# Altium project buffer_board.PrjPcb
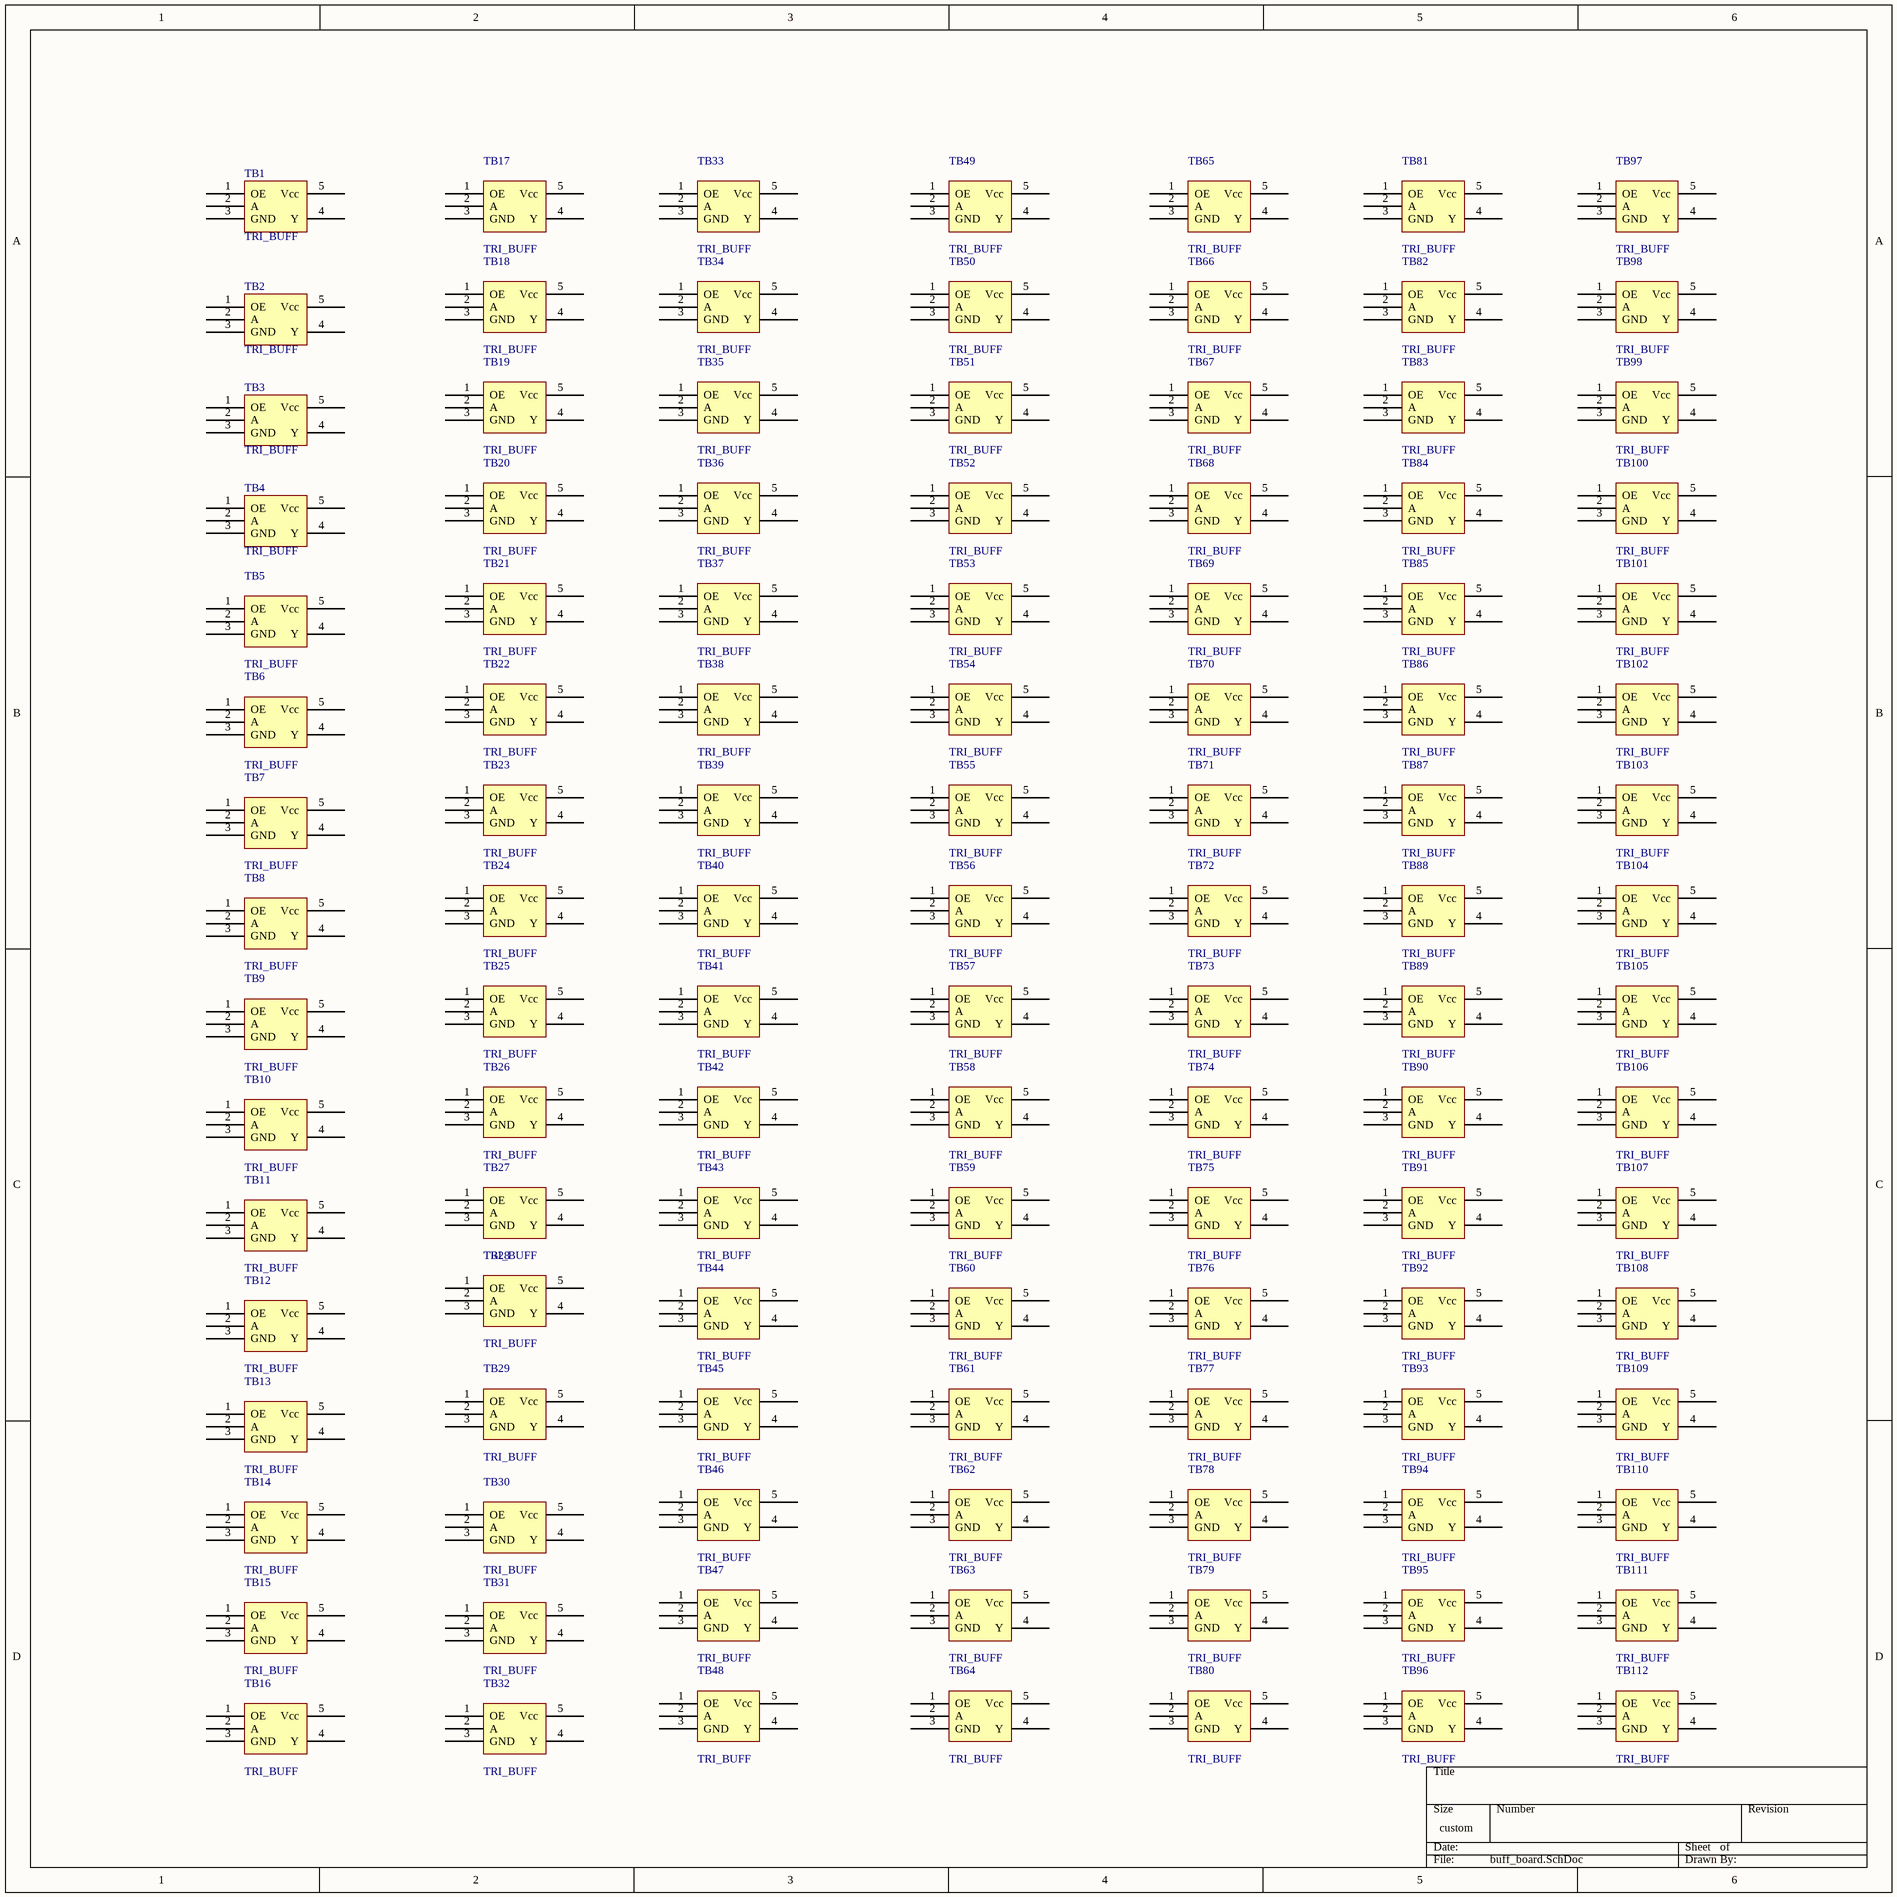
[diagram p0: buff_board.SchDoc]
1 sheet, 112 parts. Net scope: global (net labels, ports and power ports of the same name join across sheets).

## Sheet buff_board.SchDoc: =Buffer Board
size 381 x 381 mm; Author: Norman Gifford

### Parts
TB1  TRI_BUFF
TB2  TRI_BUFF
TB3  TRI_BUFF
TB4  TRI_BUFF
TB5  TRI_BUFF
TB6  TRI_BUFF
TB7  TRI_BUFF
TB8  TRI_BUFF
TB9  TRI_BUFF
TB10  TRI_BUFF
TB11  TRI_BUFF
TB12  TRI_BUFF
TB13  TRI_BUFF
TB14  TRI_BUFF
TB15  TRI_BUFF
TB16  TRI_BUFF
TB17  TRI_BUFF
TB18  TRI_BUFF
TB19  TRI_BUFF
TB20  TRI_BUFF
TB21  TRI_BUFF
TB22  TRI_BUFF
TB23  TRI_BUFF
TB24  TRI_BUFF
TB25  TRI_BUFF
TB26  TRI_BUFF
TB27  TRI_BUFF
TB28  TRI_BUFF
TB29  TRI_BUFF
TB30  TRI_BUFF
TB31  TRI_BUFF
TB32  TRI_BUFF
TB33  TRI_BUFF
TB34  TRI_BUFF
TB35  TRI_BUFF
TB36  TRI_BUFF
TB37  TRI_BUFF
TB38  TRI_BUFF
TB39  TRI_BUFF
TB40  TRI_BUFF
TB41  TRI_BUFF
TB42  TRI_BUFF
TB43  TRI_BUFF
TB44  TRI_BUFF
TB45  TRI_BUFF
TB46  TRI_BUFF
TB47  TRI_BUFF
TB48  TRI_BUFF
TB49  TRI_BUFF
TB50  TRI_BUFF
TB51  TRI_BUFF
TB52  TRI_BUFF
TB53  TRI_BUFF
TB54  TRI_BUFF
TB55  TRI_BUFF
TB56  TRI_BUFF
TB57  TRI_BUFF
TB58  TRI_BUFF
TB59  TRI_BUFF
TB60  TRI_BUFF
TB61  TRI_BUFF
TB62  TRI_BUFF
TB63  TRI_BUFF
TB64  TRI_BUFF
TB65  TRI_BUFF
TB66  TRI_BUFF
TB67  TRI_BUFF
TB68  TRI_BUFF
TB69  TRI_BUFF
TB70  TRI_BUFF
TB71  TRI_BUFF
TB72  TRI_BUFF
TB73  TRI_BUFF
TB74  TRI_BUFF
TB75  TRI_BUFF
TB76  TRI_BUFF
TB77  TRI_BUFF
TB78  TRI_BUFF
TB79  TRI_BUFF
TB80  TRI_BUFF
TB81  TRI_BUFF
TB82  TRI_BUFF
TB83  TRI_BUFF
TB84  TRI_BUFF
TB85  TRI_BUFF
TB86  TRI_BUFF
TB87  TRI_BUFF
TB88  TRI_BUFF
TB89  TRI_BUFF
TB90  TRI_BUFF
TB91  TRI_BUFF
TB92  TRI_BUFF
TB93  TRI_BUFF
TB94  TRI_BUFF
TB95  TRI_BUFF
TB96  TRI_BUFF
TB97  TRI_BUFF
TB98  TRI_BUFF
TB99  TRI_BUFF
TB100  TRI_BUFF
TB101  TRI_BUFF
TB102  TRI_BUFF
TB103  TRI_BUFF
TB104  TRI_BUFF
TB105  TRI_BUFF
TB106  TRI_BUFF
TB107  TRI_BUFF
TB108  TRI_BUFF
TB109  TRI_BUFF
TB110  TRI_BUFF
TB111  TRI_BUFF
TB112  TRI_BUFF

### Nets

Not connected (* = marked no-connect by the designer): TB1 1(OE) 2(A) 3(GND) 4(Y) 5(Vcc); TB2 1(OE) 2(A) 3(GND) 4(Y) 5(Vcc); TB3 1(OE) 2(A) 3(GND) 4(Y) 5(Vcc); TB4 1(OE) 2(A) 3(GND) 4(Y) 5(Vcc); TB5 1(OE) 2(A) 3(GND) 4(Y) 5(Vcc); TB6 1(OE) 2(A) 3(GND) 4(Y) 5(Vcc); TB7 1(OE) 2(A) 3(GND) 4(Y) 5(Vcc); TB8 1(OE) 2(A) 3(GND) 4(Y) 5(Vcc); TB9 1(OE) 2(A) 3(GND) 4(Y) 5(Vcc); TB10 1(OE) 2(A) 3(GND) 4(Y) 5(Vcc); TB11 1(OE) 2(A) 3(GND) 4(Y) 5(Vcc); TB12 1(OE) 2(A) 3(GND) 4(Y) 5(Vcc); TB13 1(OE) 2(A) 3(GND) 4(Y) 5(Vcc); TB14 1(OE) 2(A) 3(GND) 4(Y) 5(Vcc); TB15 1(OE) 2(A) 3(GND) 4(Y) 5(Vcc); TB16 1(OE) 2(A) 3(GND) 4(Y) 5(Vcc); TB17 1(OE) 2(A) 3(GND) 4(Y) 5(Vcc); TB18 1(OE) 2(A) 3(GND) 4(Y) 5(Vcc); TB19 1(OE) 2(A) 3(GND) 4(Y) 5(Vcc); TB20 1(OE) 2(A) 3(GND) 4(Y) 5(Vcc); TB21 1(OE) 2(A) 3(GND) 4(Y) 5(Vcc); TB22 1(OE) 2(A) 3(GND) 4(Y) 5(Vcc); TB23 1(OE) 2(A) 3(GND) 4(Y) 5(Vcc); TB24 1(OE) 2(A) 3(GND) 4(Y) 5(Vcc); TB25 1(OE) 2(A) 3(GND) 4(Y) 5(Vcc); TB26 1(OE) 2(A) 3(GND) 4(Y) 5(Vcc); TB27 1(OE) 2(A) 3(GND) 4(Y) 5(Vcc); TB28 1(OE) 2(A) 3(GND) 4(Y) 5(Vcc); TB29 1(OE) 2(A) 3(GND) 4(Y) 5(Vcc); TB30 1(OE) 2(A) 3(GND) 4(Y) 5(Vcc); TB31 1(OE) 2(A) 3(GND) 4(Y) 5(Vcc); TB32 1(OE) 2(A) 3(GND) 4(Y) 5(Vcc); TB33 1(OE) 2(A) 3(GND) 4(Y) 5(Vcc); TB34 1(OE) 2(A) 3(GND) 4(Y) 5(Vcc); TB35 1(OE) 2(A) 3(GND) 4(Y) 5(Vcc); TB36 1(OE) 2(A) 3(GND) 4(Y) 5(Vcc); TB37 1(OE) 2(A) 3(GND) 4(Y) 5(Vcc); TB38 1(OE) 2(A) 3(GND) 4(Y) 5(Vcc); TB39 1(OE) 2(A) 3(GND) 4(Y) 5(Vcc); TB40 1(OE) 2(A) 3(GND) 4(Y) 5(Vcc); TB41 1(OE) 2(A) 3(GND) 4(Y) 5(Vcc); TB42 1(OE) 2(A) 3(GND) 4(Y) 5(Vcc); TB43 1(OE) 2(A) 3(GND) 4(Y) 5(Vcc); TB44 1(OE) 2(A) 3(GND) 4(Y) 5(Vcc); TB45 1(OE) 2(A) 3(GND) 4(Y) 5(Vcc); TB46 1(OE) 2(A) 3(GND) 4(Y) 5(Vcc); TB47 1(OE) 2(A) 3(GND) 4(Y) 5(Vcc); TB48 1(OE) 2(A) 3(GND) 4(Y) 5(Vcc); TB49 1(OE) 2(A) 3(GND) 4(Y) 5(Vcc); TB50 1(OE) 2(A) 3(GND) 4(Y) 5(Vcc); TB51 1(OE) 2(A) 3(GND) 4(Y) 5(Vcc); TB52 1(OE) 2(A) 3(GND) 4(Y) 5(Vcc); TB53 1(OE) 2(A) 3(GND) 4(Y) 5(Vcc); TB54 1(OE) 2(A) 3(GND) 4(Y) 5(Vcc); TB55 1(OE) 2(A) 3(GND) 4(Y) 5(Vcc); TB56 1(OE) 2(A) 3(GND) 4(Y) 5(Vcc); TB57 1(OE) 2(A) 3(GND) 4(Y) 5(Vcc); TB58 1(OE) 2(A) 3(GND) 4(Y) 5(Vcc); TB59 1(OE) 2(A) 3(GND) 4(Y) 5(Vcc); TB60 1(OE) 2(A) 3(GND) 4(Y) 5(Vcc); TB61 1(OE) 2(A) 3(GND) 4(Y) 5(Vcc); TB62 1(OE) 2(A) 3(GND) 4(Y) 5(Vcc); TB63 1(OE) 2(A) 3(GND) 4(Y) 5(Vcc); TB64 1(OE) 2(A) 3(GND) 4(Y) 5(Vcc); TB65 1(OE) 2(A) 3(GND) 4(Y) 5(Vcc); TB66 1(OE) 2(A) 3(GND) 4(Y) 5(Vcc); TB67 1(OE) 2(A) 3(GND) 4(Y) 5(Vcc); TB68 1(OE) 2(A) 3(GND) 4(Y) 5(Vcc); TB69 1(OE) 2(A) 3(GND) 4(Y) 5(Vcc); TB70 1(OE) 2(A) 3(GND) 4(Y) 5(Vcc); TB71 1(OE) 2(A) 3(GND) 4(Y) 5(Vcc); TB72 1(OE) 2(A) 3(GND) 4(Y) 5(Vcc); TB73 1(OE) 2(A) 3(GND) 4(Y) 5(Vcc); TB74 1(OE) 2(A) 3(GND) 4(Y) 5(Vcc); TB75 1(OE) 2(A) 3(GND) 4(Y) 5(Vcc); TB76 1(OE) 2(A) 3(GND) 4(Y) 5(Vcc); TB77 1(OE) 2(A) 3(GND) 4(Y) 5(Vcc); TB78 1(OE) 2(A) 3(GND) 4(Y) 5(Vcc); TB79 1(OE) 2(A) 3(GND) 4(Y) 5(Vcc); TB80 1(OE) 2(A) 3(GND) 4(Y) 5(Vcc); TB81 1(OE) 2(A) 3(GND) 4(Y) 5(Vcc); TB82 1(OE) 2(A) 3(GND) 4(Y) 5(Vcc); TB83 1(OE) 2(A) 3(GND) 4(Y) 5(Vcc); TB84 1(OE) 2(A) 3(GND) 4(Y) 5(Vcc); TB85 1(OE) 2(A) 3(GND) 4(Y) 5(Vcc); TB86 1(OE) 2(A) 3(GND) 4(Y) 5(Vcc); TB87 1(OE) 2(A) 3(GND) 4(Y) 5(Vcc); TB88 1(OE) 2(A) 3(GND) 4(Y) 5(Vcc); TB89 1(OE) 2(A) 3(GND) 4(Y) 5(Vcc); TB90 1(OE) 2(A) 3(GND) 4(Y) 5(Vcc); TB91 1(OE) 2(A) 3(GND) 4(Y) 5(Vcc); TB92 1(OE) 2(A) 3(GND) 4(Y) 5(Vcc); TB93 1(OE) 2(A) 3(GND) 4(Y) 5(Vcc); TB94 1(OE) 2(A) 3(GND) 4(Y) 5(Vcc); TB95 1(OE) 2(A) 3(GND) 4(Y) 5(Vcc); TB96 1(OE) 2(A) 3(GND) 4(Y) 5(Vcc); TB97 1(OE) 2(A) 3(GND) 4(Y) 5(Vcc); TB98 1(OE) 2(A) 3(GND) 4(Y) 5(Vcc); TB99 1(OE) 2(A) 3(GND) 4(Y) 5(Vcc); TB100 1(OE) 2(A) 3(GND) 4(Y) 5(Vcc); TB101 1(OE) 2(A) 3(GND) 4(Y) 5(Vcc); TB102 1(OE) 2(A) 3(GND) 4(Y) 5(Vcc); TB103 1(OE) 2(A) 3(GND) 4(Y) 5(Vcc); TB104 1(OE) 2(A) 3(GND) 4(Y) 5(Vcc); TB105 1(OE) 2(A) 3(GND) 4(Y) 5(Vcc); TB106 1(OE) 2(A) 3(GND) 4(Y) 5(Vcc); TB107 1(OE) 2(A) 3(GND) 4(Y) 5(Vcc); TB108 1(OE) 2(A) 3(GND) 4(Y) 5(Vcc); TB109 1(OE) 2(A) 3(GND) 4(Y) 5(Vcc); TB110 1(OE) 2(A) 3(GND) 4(Y) 5(Vcc); TB111 1(OE) 2(A) 3(GND) 4(Y) 5(Vcc); TB112 1(OE) 2(A) 3(GND) 4(Y) 5(Vcc)

### Library data of the parts
TB1-TB112 = TRI_BUFF: Supplier 1: Digi-Key; Supplier Part Number 1: 296-11606-1-ND